# Altium schematic sheet CAN.SchDoc
size A4
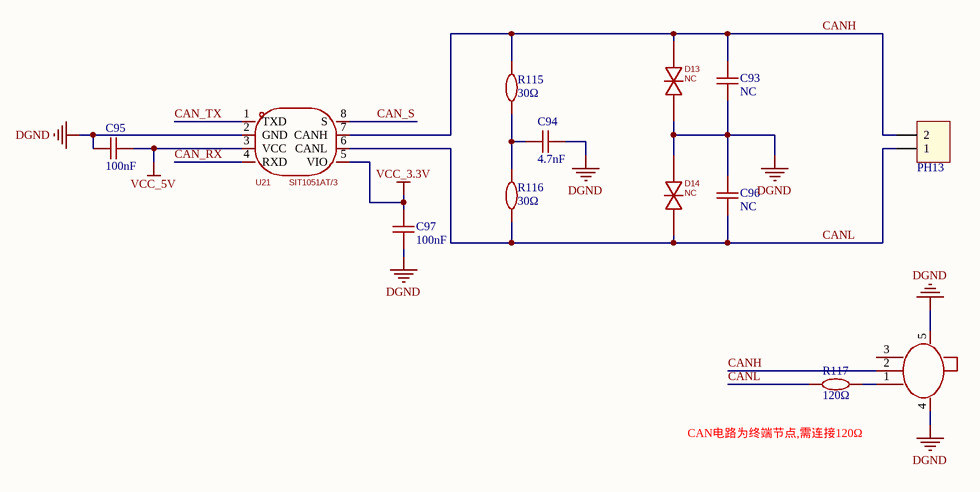
[diagram p0: CAN.SchDoc]

## Parts
C93  NC  [C0603]
C94  4.7nF  [C0603]
C95  100nF  [C0603]
C96  NC  [C0603]
C97  100nF  [C0603]
D13  NC  [SOD-523_L1.2-W0.8-LS1.6-BI]
D14  NC  [SOD-523_L1.2-W0.8-LS1.6-BI]
PH13  PH2.0-2P  [PH2.0-2P 弯针]  (value not drawn)
R115  30Ω  [R0603]
R116  30Ω  [R0603]
R117  120Ω  [R0603]
SW1  MINI MSK12CO2  [SW-SMD_MSK12CO2]  (value not drawn)
U21  SIT1051AT/3  [SOP-8_L4.9-W3.9-P1.27-LS6.0-BL]

## Nets
DGND: C93.1 C94.2 C95.2 C96.2 C97.2 D13.1(C) D14.2(A) SW1.4 SW1.5 U21.2(GND)
VCC_3.3V: C97.1 U21.5(VIO)
VCC_5V: C95.1 U21.3(VCC)
CAN_RX: U21.4(RXD)
CAN_S: U21.8(S)
CAN_TX: U21.1(TXD)
CANH: C93.2 D13.2(A) PH13.2 R115.2 SW1.2 U21.7(CANH)
CANL: C96.1 D14.1(C) PH13.1 R116.1 R117.2 U21.6(CANL)
NetC94_1: C94.1 R115.1 R116.2
NetR117_1: R117.1 SW1.1

Not connected (* = marked no-connect by the designer): SW1 3

## Notes on the sheet
- CAN电路为终端节点,需连接120Ω

## Library data of the parts
C93 C96 = NC,C0603: ComponentLink1Description: 供应商链接; ComponentLink1URL: http://www.szlcsc.com/product/details_16531.html
C94 = 4.7nF/50V,C0603: 贴片电容,X7R; ComponentLink1Description: 供应商链接; ComponentLink1URL: http://www.szlcsc.com/product/details_16531.html
C95 C97 = 100nF/50V,C0603: 贴片电容,X7R; ComponentLink1Description: 供应商链接; ComponentLink1URL: http://www.szlcsc.com/product/details_16531.html
D13 D14 = NC,RSB6.8STE61: RSB6.8STE61
R115 R116 = 30Ω,R0603: 贴片电阻
R117 = 120Ω,R0603: 贴片电阻
SW1 = MINI MSK12CO2: Manufacturer: SHOU HAN(首韩); Add into BOM: yes; Circuit: 单刀双掷; Actuator Style: 矩形柱状; Switch Height: 1.4mm; Actuator Color: 白色; Current Rating: 50mA; Voltage Rating: 12V; Life: 1万次; Symbol: MINI MSK12CO2; Device: MINI MSK12CO2; LCSC Part Name: 迷你七脚两档侧拨拨动 mini七7脚 微型拨动; Supplier Part: C2681570; Manufacturer Part: MINI MSK12CO2; Supplier Footprint: SMD; JLCPCB Part Class: Extended Part; Datasheet: https://item.szlcsc.com/datasheet/MINI%2520MSK12CO2/2774913.html; Supplier: LCSC; Convert to PCB: yes; Termination Style: SMD接片; Length: 5mm; Width: 2.75mm; Mounting Type: 卧贴; Operating Temperature: -25℃~+70℃
U21 = SIT1051AT/3: Manufacturer: SIT(芯力特); Add into BOM: yes; Data Rate: 5Mbps; Supply Voltage: 4.5V~5.5V; Symbol: SIT1051AT/3; Device: SIT1051AT/3; LCSC Part Name: SIT1051A CAN FD静音模式总线收发器; Supplier Part: C5382551; Manufacturer Part: SIT1051AT/3; Supplier Footprint: SOP-8; JLCPCB Part Class: Extended Part; Datasheet: https://atta.szlcsc.com/upload/public/pdf/source/20230320/C85B42C3F9CED8A268DA50D1BF0BE466.pdf; Supplier: LCSC; Convert to PCB: yes; Type: CAN-FD收发器; Supply Current: -; Operating Temperature: -40℃~+150℃